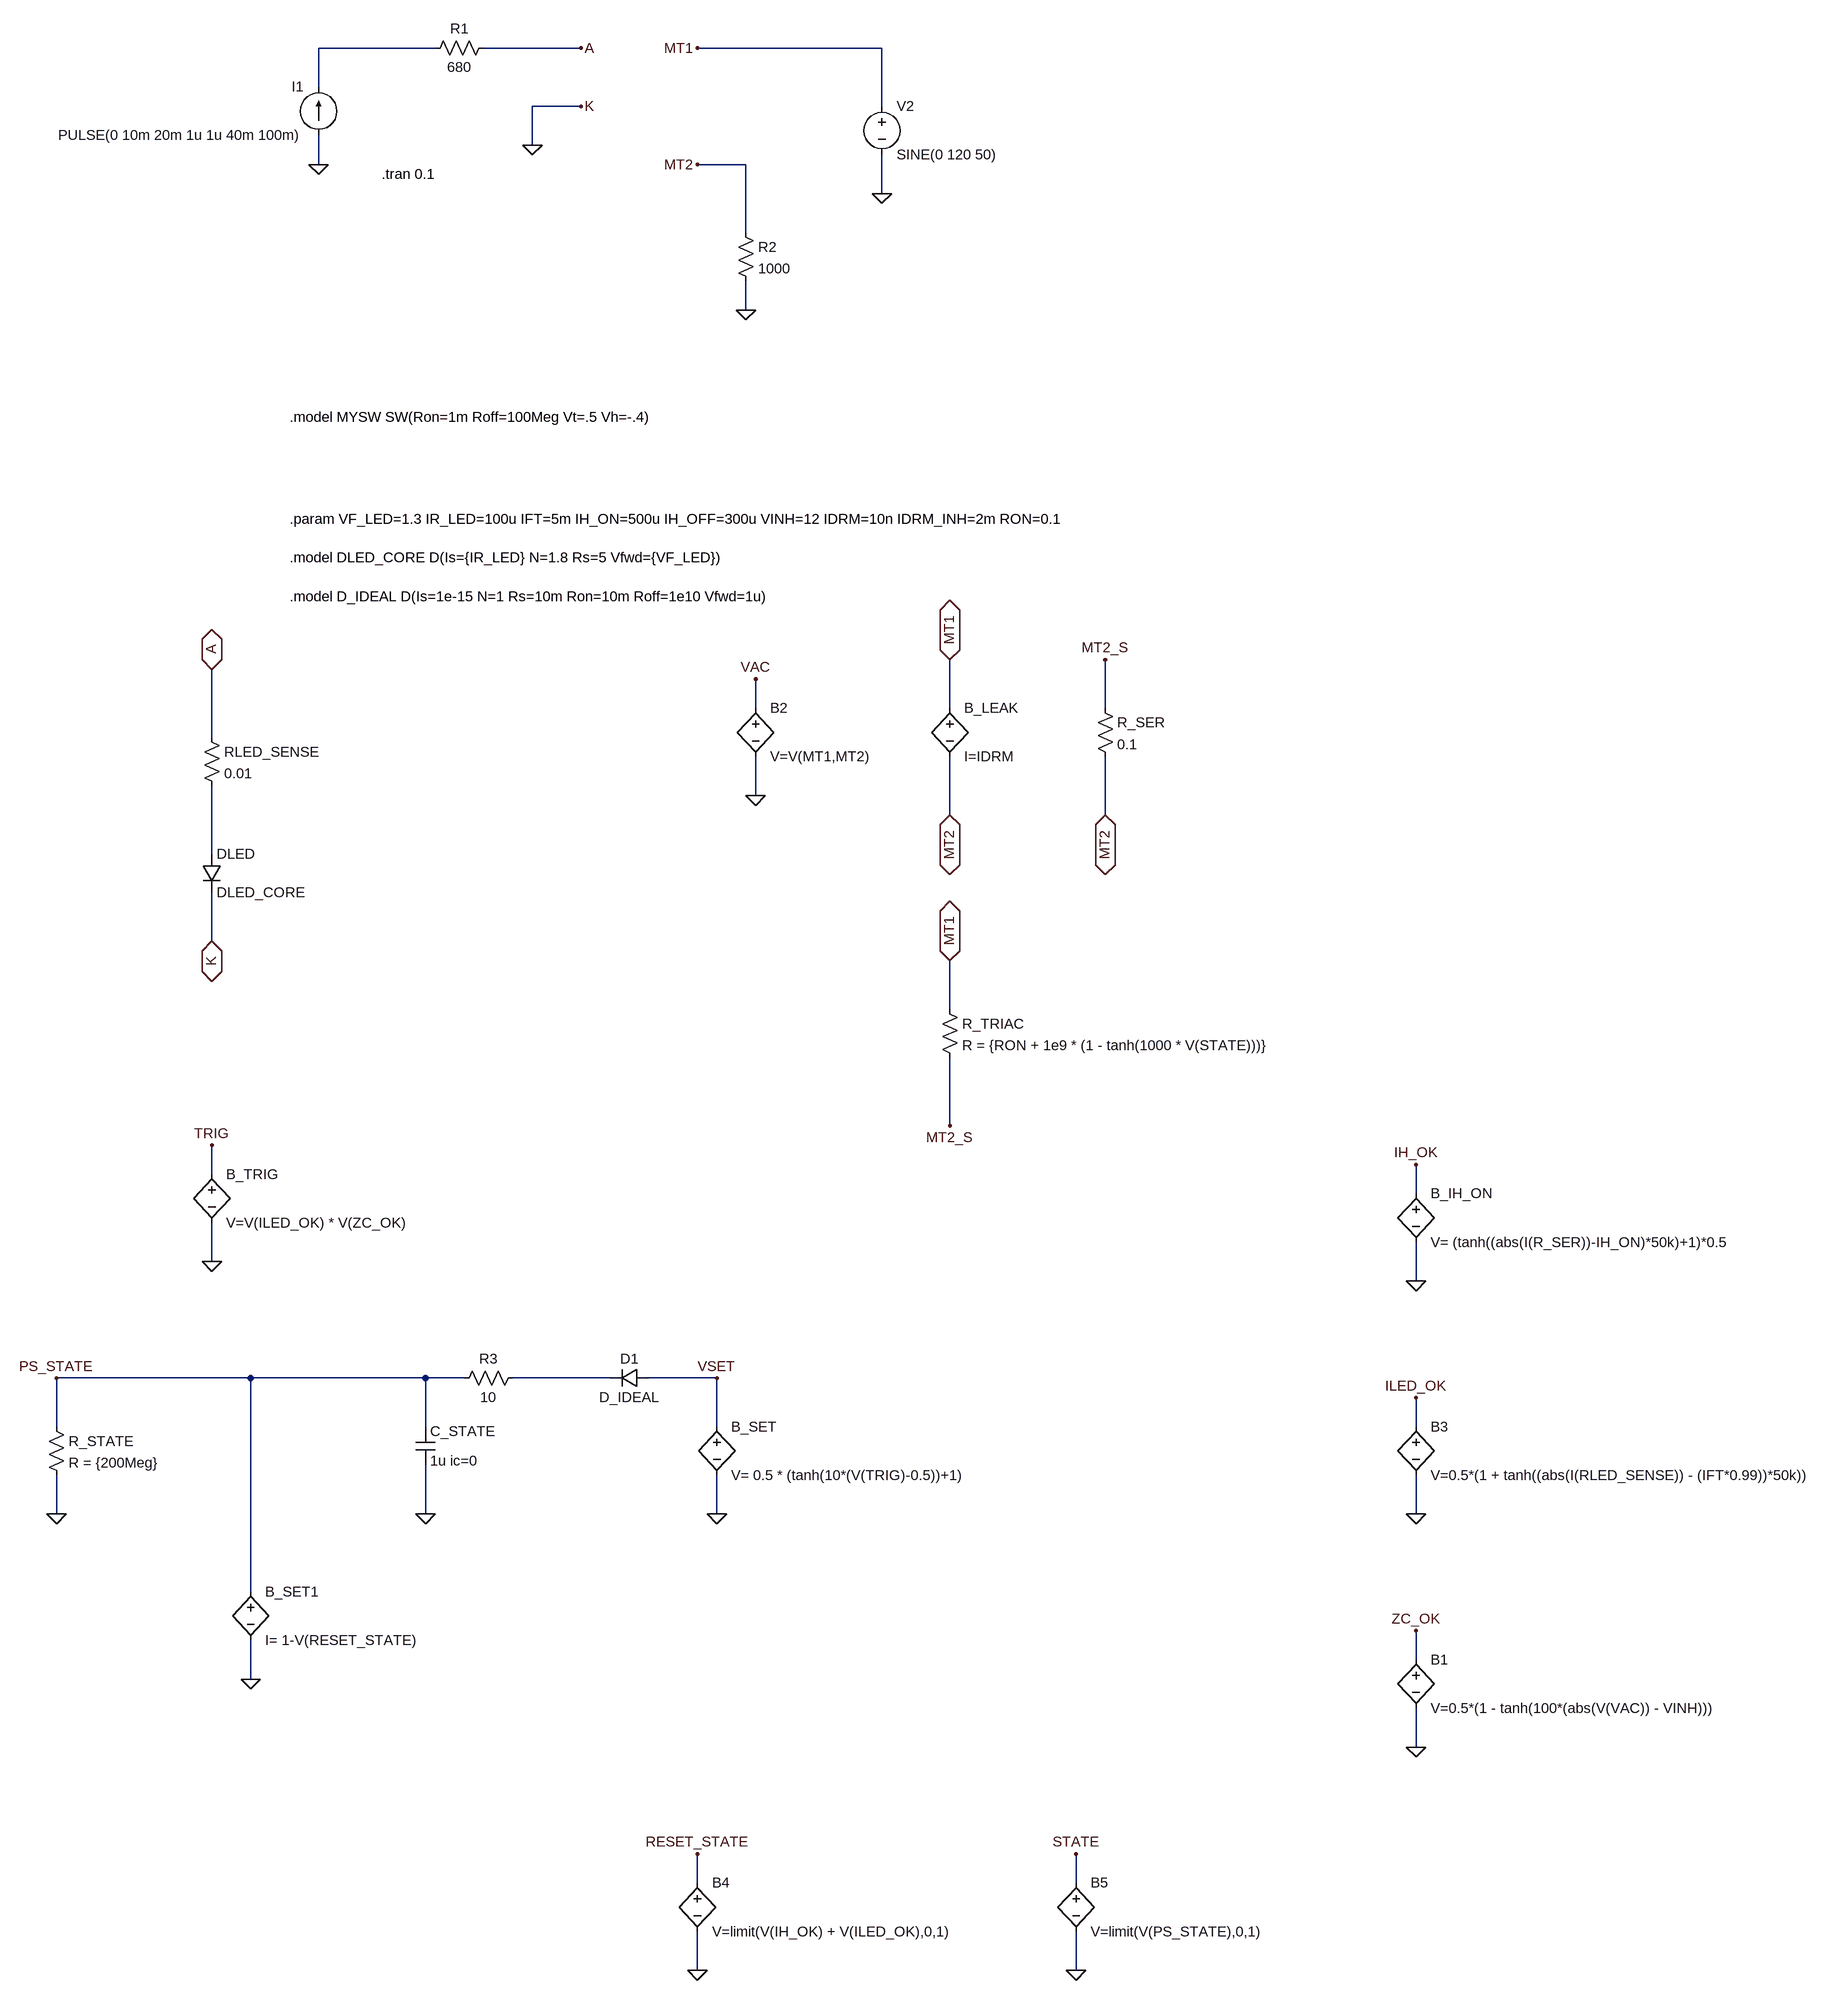
[diagram p0: schematic MOC3083.asc]
MOC3083.asc, the LTspice schematic file:
Version 4.1
SHEET 1 2304 3348
WIRE -48 144 -240 144
WIRE 192 144 32 144
WIRE 688 144 384 144
WIRE -240 208 -240 144
WIRE 192 240 112 240
WIRE 688 240 688 144
WIRE 112 304 112 240
WIRE -240 336 -240 288
WIRE 464 336 384 336
WIRE 688 384 688 320
WIRE 464 448 464 336
WIRE 464 576 464 528
WIRE 480 1232 480 1184
WIRE 800 1232 800 1152
WIRE 1056 1232 1056 1152
WIRE -416 1280 -416 1168
WIRE 480 1376 480 1312
WIRE 800 1408 800 1312
WIRE 1056 1408 1056 1312
WIRE -416 1472 -416 1360
WIRE -416 1616 -416 1536
WIRE 800 1728 800 1648
WIRE 800 1920 800 1808
WIRE -416 2000 -416 1952
WIRE 1568 2032 1568 1984
WIRE -416 2144 -416 2080
WIRE 1568 2176 1568 2112
WIRE -352 2336 -672 2336
WIRE -64 2336 -352 2336
WIRE 0 2336 -64 2336
WIRE 240 2336 80 2336
WIRE 416 2336 304 2336
WIRE -672 2416 -672 2336
WIRE -64 2416 -64 2336
WIRE 416 2416 416 2336
WIRE 1568 2416 1568 2368
WIRE -672 2560 -672 2496
WIRE -64 2560 -64 2480
WIRE 416 2560 416 2496
WIRE 1568 2560 1568 2496
WIRE -352 2688 -352 2336
WIRE 1568 2800 1568 2752
WIRE -352 2832 -352 2768
WIRE 1568 2944 1568 2880
WIRE 384 3168 384 3120
WIRE 1008 3168 1008 3120
WIRE 384 3312 384 3248
WIRE 1008 3312 1008 3248
FLAG 112 304 0
FLAG -240 336 0
FLAG 464 576 0
FLAG 688 384 0
FLAG 192 144 A
FLAG 192 240 K
FLAG 384 144 MT1
FLAG 384 336 MT2
FLAG -416 1168 A
IOPIN -416 1168 BiDir
FLAG -416 1616 K
IOPIN -416 1616 BiDir
FLAG 800 1408 MT2
IOPIN 800 1408 BiDir
FLAG 800 1152 MT1
IOPIN 800 1152 BiDir
FLAG 1568 2944 0
FLAG 1568 2752 ZC_OK
FLAG 480 1376 0
FLAG 480 1184 VAC
FLAG -416 2144 0
FLAG -416 1952 TRIG
FLAG -672 2560 0
FLAG -64 2560 0
FLAG -672 2336 PS_STATE
FLAG 416 2560 0
FLAG 1568 2176 0
FLAG 1568 1984 IH_OK
FLAG 1056 1408 MT2
IOPIN 1056 1408 BiDir
FLAG 1056 1152 MT2_S
FLAG 800 1648 MT1
IOPIN 800 1648 BiDir
FLAG 800 1920 MT2_S
FLAG 1568 2368 ILED_OK
FLAG 384 3312 0
FLAG 384 3120 RESET_STATE
FLAG 416 2336 VSET
FLAG 1568 2560 0
FLAG -352 2832 0
FLAG 1008 3312 0
FLAG 1008 3120 STATE
SYMBOL res 48 128 R90
WINDOW 0 0 56 VBottom 2
WINDOW 3 32 56 VTop 2
SYMATTR InstName R1
SYMATTR Value 680
SYMBOL res 448 432 R0
SYMATTR InstName R2
SYMATTR Value 1000
SYMBOL voltage 688 224 R0
WINDOW 123 0 0 Left 0
WINDOW 39 0 0 Left 0
SYMATTR InstName V2
SYMATTR Value SINE(0 120 50)
SYMBOL diode -432 1472 R0
SYMATTR InstName DLED
SYMATTR Value DLED_CORE
SYMBOL bv 1568 2784 R0
SYMATTR InstName B1
SYMATTR Value V=0.5*(1 - tanh(100*(abs(V(VAC)) - VINH)))
SYMBOL res -432 1264 R0
SYMATTR InstName RLED_SENSE
SYMATTR Value 0.01
SYMBOL bv 480 1216 R0
SYMATTR InstName B2
SYMATTR Value V=V(MT1,MT2)
SYMBOL bv -416 1984 R0
SYMATTR InstName B_TRIG
SYMATTR Value V=V(ILED_OK) * V(ZC_OK)
SYMBOL res -688 2400 R0
SYMATTR InstName R_STATE
SYMATTR Value R = {200Meg}
SYMBOL cap -80 2416 R0
SYMATTR InstName C_STATE
SYMATTR Value 1u ic=0
SYMBOL bv 416 2400 R0
SYMATTR InstName B_SET
SYMATTR Value V= 0.5 * (tanh(10*(V(TRIG)-0.5))+1)
SYMBOL bv 1568 2016 R0
SYMATTR InstName B_IH_ON
SYMATTR Value V= (tanh((abs(I(R_SER))-IH_ON)*50k)+1)*0.5
SYMBOL res 1040 1216 R0
SYMATTR InstName R_SER
SYMATTR Value 0.1
SYMBOL res 784 1712 R0
SYMATTR InstName R_TRIAC
SYMATTR Value R = {RON + 1e9 * (1 - tanh(1000 * V(STATE)))}
SYMBOL bv 800 1216 R0
SYMATTR InstName B_LEAK
SYMATTR Value I=IDRM
SYMBOL res 96 2320 R90
WINDOW 0 0 56 VBottom 2
WINDOW 3 32 56 VTop 2
SYMATTR InstName R3
SYMATTR Value 10
SYMBOL diode 304 2320 R90
WINDOW 0 0 32 VBottom 2
WINDOW 3 32 32 VTop 2
SYMATTR InstName D1
SYMATTR Value D_IDEAL
SYMBOL bv 1568 2400 R0
SYMATTR InstName B3
SYMATTR Value V=0.5*(1 + tanh((abs(I(RLED_SENSE)) - (IFT*0.99))*50k))
SYMBOL bv 384 3152 R0
SYMATTR InstName B4
SYMATTR Value V=limit(V(IH_OK) + V(ILED_OK),0,1)
SYMBOL bv -352 2672 R0
SYMATTR InstName B_SET1
SYMATTR Value I= 1-V(RESET_STATE)
SYMBOL bv 1008 3152 R0
SYMATTR InstName B5
SYMATTR Value V=limit(V(PS_STATE),0,1)
SYMBOL current -240 288 R180
WINDOW 0 24 80 Left 2
WINDOW 3 24 0 Left 2
WINDOW 123 0 0 Left 0
WINDOW 39 0 0 Left 0
SYMATTR InstName I1
SYMATTR Value PULSE(0 10m 20m 1u 1u 40m 100m)
TEXT -136 352 Left 2 !.tran 0.1
TEXT -288 920 Left 2 !.param VF_LED=1.3 IR_LED=100u IFT=5m IH_ON=500u IH_OFF=300u VINH=12 IDRM=10n IDRM_INH=2m RON=0.1
TEXT -288 984 Left 2 !.model DLED_CORE D(Is={IR_LED} N=1.8 Rs=5 Vfwd={VF_LED})
TEXT -288 1048 Left 2 !.model D_IDEAL D(Is=1e-15 N=1 Rs=10m Ron=10m Roff=1e10 Vfwd=1u)
TEXT -288 752 Left 2 !.model MYSW SW(Ron=1m Roff=100Meg Vt=.5 Vh=-.4)

The netlist it stands for:
* MOC3083.asc
R1 A N001 680
R2 MT2 0 1000
V2 MT1 0 SINE(0 120 50)
DLED N002 0 DLED_CORE
B1 ZC_OK 0 V=0.5*(1 - tanh(100*(abs(V(VAC)) - VINH)))
RLED_SENSE A N002 0.01
B2 VAC 0 V=V(MT1,MT2)
B_TRIG TRIG 0 V=V(ILED_OK) * V(ZC_OK)
R_STATE PS_STATE 0 R = {200Meg}
C_STATE PS_STATE 0 1u ic=0
B_SET VSET 0 V= 0.5 * (tanh(10*(V(TRIG)-0.5))+1)
B_IH_ON IH_OK 0 V= (tanh((abs(I(R_SER))-IH_ON)*50k)+1)*0.5
R_SER MT2_S MT2 0.1
R_TRIAC MT1 MT2_S R = {RON + 1e9 * (1 - tanh(1000 * V(STATE)))}
B_LEAK MT1 MT2 I=IDRM
R3 N003 PS_STATE 10
D1 VSET N003 D_IDEAL
B3 ILED_OK 0 V=0.5*(1 + tanh((abs(I(RLED_SENSE)) - (IFT*0.99))*50k))
B4 RESET_STATE 0 V=limit(V(IH_OK) + V(ILED_OK),0,1)
B_SET1 PS_STATE 0 I= 1-V(RESET_STATE)
B5 STATE 0 V=limit(V(PS_STATE),0,1)
I1 0 N001 PULSE(0 10m 20m 1u 1u 40m 100m)
.model D D
.lib standard.dio
.tran 0.1
.param VF_LED=1.3 IR_LED=100u IFT=5m IH_ON=500u IH_OFF=300u VINH=12 IDRM=10n IDRM_INH=2m RON=0.1
.model DLED_CORE D(Is={IR_LED} N=1.8 Rs=5 Vfwd={VF_LED})
.model D_IDEAL D(Is=1e-15 N=1 Rs=10m Ron=10m Roff=1e10 Vfwd=1u)
.model MYSW SW(Ron=1m Roff=100Meg Vt=.5 Vh=-.4)
.backanno
.end